# EAGLE design HandschuhProfessionell (EAGLE 6.5.0)
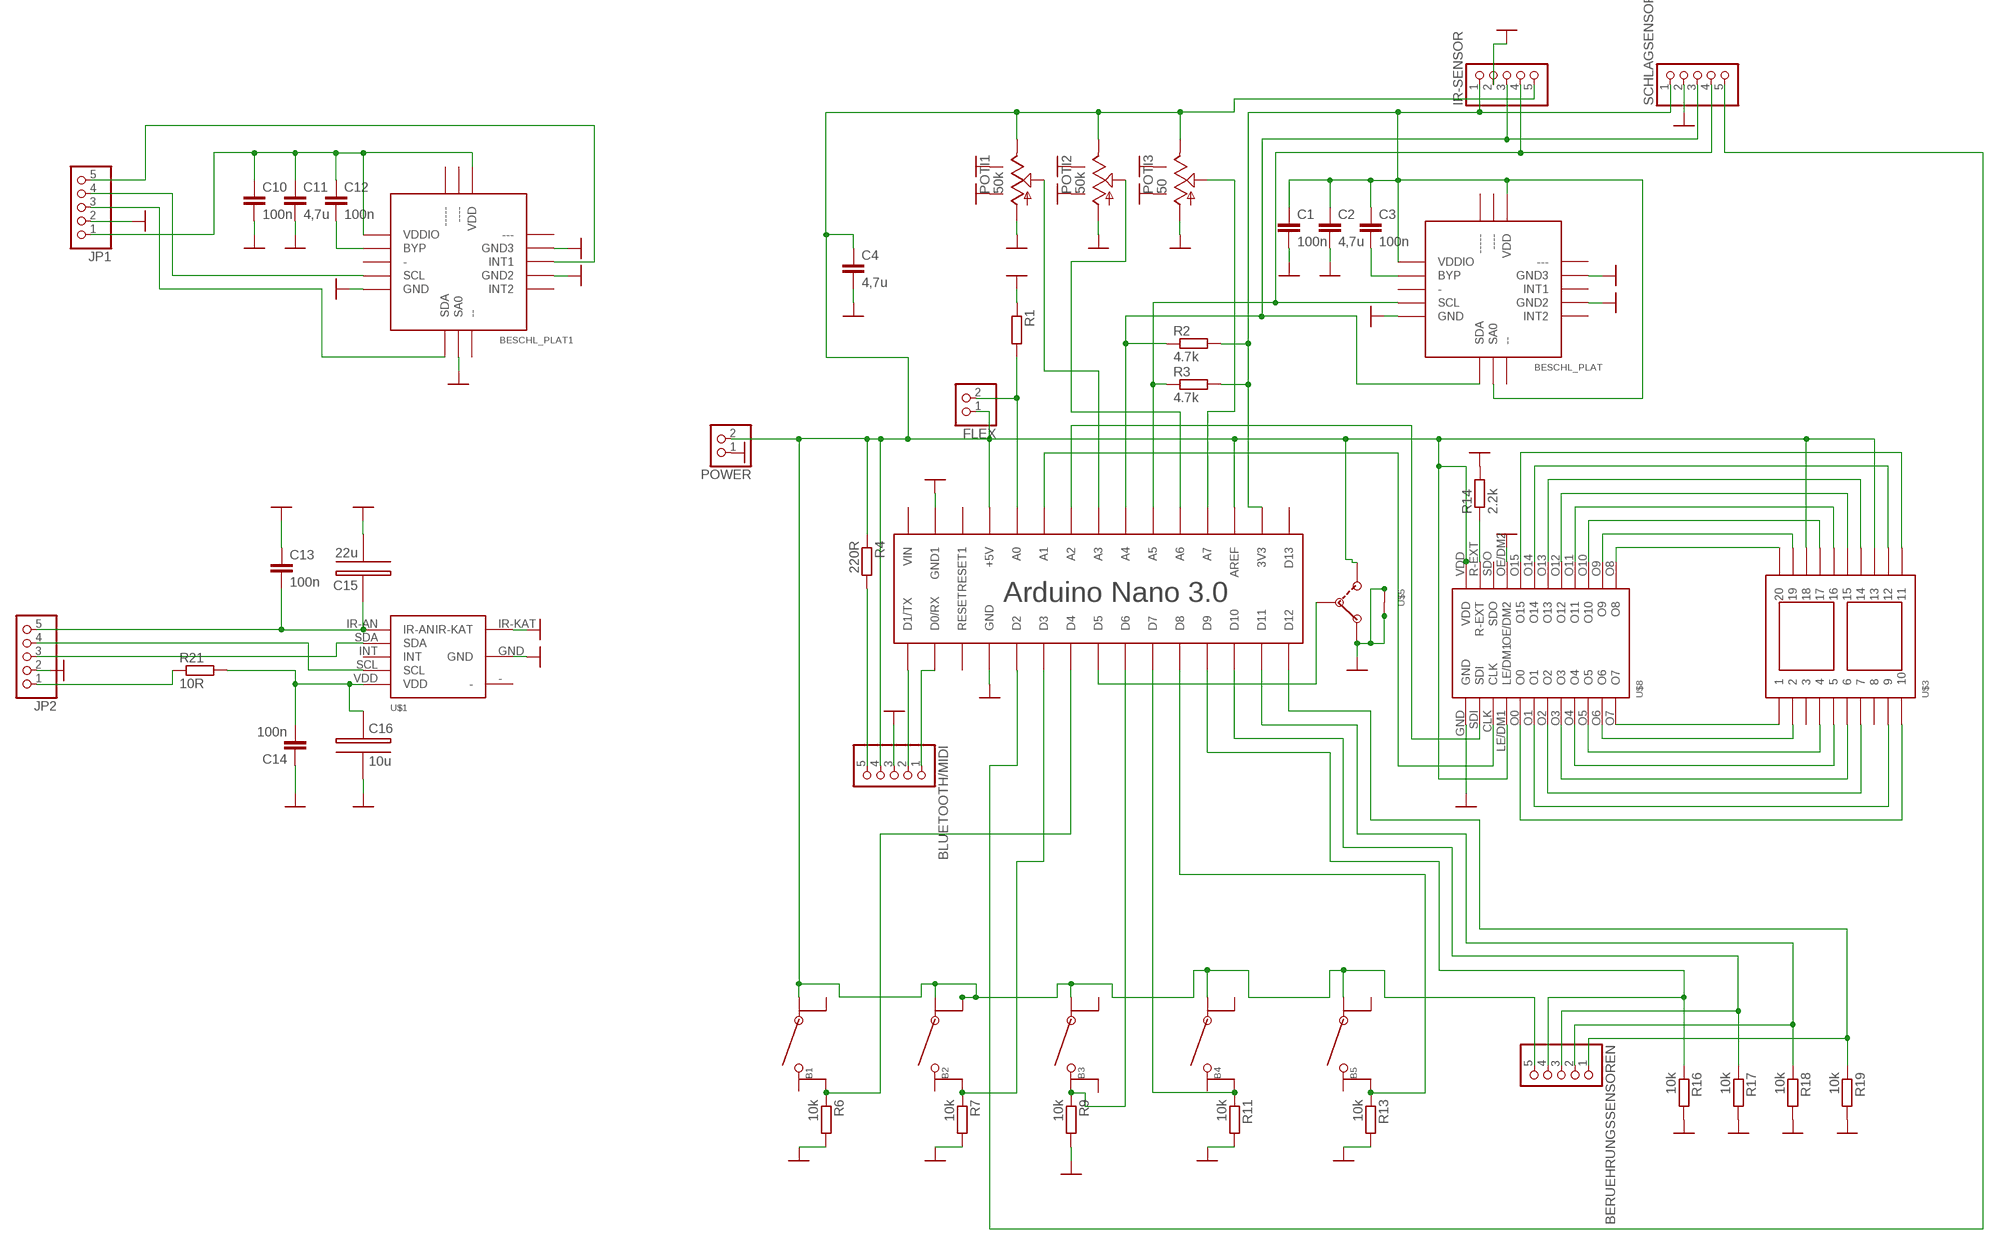
[diagram p0: schematic, sheet 1]

## Parts
B1  BUTTON  [BUTTON]
B2  BUTTON  [BUTTON]
B3  BUTTON  [BUTTON]
B4  BUTTON  [BUTTON]
B5  BUTTON  [BUTTON]
BERUEHRUNGSSENSOREN  PINHD-1X5  [1X05]
BESCHL_PLAT  BESCHLEUNIGSUNGSSENSOR  [BESCHLEUNIGUNGSSENSOR]
BESCHL_PLAT1  BESCHLEUNIGSUNGSSENSOR  [BESCHLEUNIGUNGSSENSOR]
BLUETOOTH/MIDI  PINHD-1X5  [1X05]
C1  100n  C-EUC0805  [C0805]
C2  4,7u  C-EUC0805  [C0805]
C3  100n  C-EUC0805  [C0805]
C4  4,7u  C-EUC0805  [C0805]
C10  100n  C-EUC0805  [C0805]
C11  4,7u  C-EUC0805  [C0805]
C12  100n  C-EUC0805  [C0805]
C13  100n  C-EUC0805  [C0805]
C14  100n  C-EUC0805  [C0805]
C15  22u  22U-KONDENSATOR  [22U-KONDENSATOR]
C16  10u  22U-KONDENSATOR  [22U-KONDENSATOR]
FLEX  PINHD-1X2  [1X02]
IR-SENSOR  PINHD-1X5  [1X05]
JP1  PINHD-1X5  [1X05]
JP2  PINHD-1X5/90  [1X05/90]
POTI1  50k  POTI  [POTI]
POTI2  50k  POTI  [POTI]
POTI3  50  POTI  [POTI]
POWER  PINHD-1X2  [1X02]
R1  R-EU_M0805  [M0805]
R2  4.7k  R-EU_M0805  [M0805]
R3  4.7k  R-EU_M0805  [M0805]
R4  220R  R-EU_M0805  [M0805]
R6  10k  R-EU_M0805  [M0805]
R7  10k  R-EU_M0805  [M0805]
R9  10k  R-EU_M0805  [M0805]
R11  10k  R-EU_M0805  [M0805]
R13  10k  R-EU_M0805  [M0805]
R14  2.2k  R-EU_M0805  [M0805]
R16  10k  R-EU_M0805  [M0805]
R17  10k  R-EU_M0805  [M0805]
R18  10k  R-EU_M0805  [M0805]
R19  10k  R-EU_M0805  [M0805]
R21  10R  R-EU_M0805  [M0805]
SCHLAGSENSOR  PINHD-1X5  [1X05]
U$1  IR-SENSOR  [IR-SENSOR]
U$2  ARDUINONANO  [PDIP-32]
U$3  7-SEGMENT  [7-SEGMENT]
U$5  SCHALTER  [SCHALTER]
U$8  7-SEGMENT-TREIBER  [7-SEGMENT-TREIBER]

## Nets
3,3V: BESCHL_PLAT.SA0 BESCHL_PLAT.VDD BESCHL_PLAT.VDDIO C1.1 C2.1 C3.1 IR-SENSOR.1 R2.2 R3.2 SCHLAGSENSOR.1 U$2.3V3
3,3V1: BESCHL_PLAT1.VDD BESCHL_PLAT1.VDDIO C10.1 C11.1 C12.1 JP1.1
5V: B1.3 B2.3 B2.4 B3.3 B4.3 B5.3 BERUEHRUNGSSENSOREN.5 BLUETOOTH/MIDI.4 C4.1 FLEX.1 IR-SENSOR.5 POTI1.VCC POTI2.VCC POTI3.VCC POWER.2 R4.1 U$2.+5V U$2.AREF U$3.13 U$3.18 U$5.3 U$8.LE/DM1 U$8.VDD
GND: BESCHL_PLAT1.GND BESCHL_PLAT1.GND2 BESCHL_PLAT1.GND3 BESCHL_PLAT1.SA0 BESCHL_PLAT.GND BESCHL_PLAT.GND2 BESCHL_PLAT.GND3 BLUETOOTH/MIDI.3 C1.2 C2.2 C4.2 C10.2 C11.2 C13.1 C14.1 C15.- C16.- IR-SENSOR.2 JP1.2 JP2.2 POTI1.FIX1(FUSS1) POTI1.FIX2(FUSS2) POTI1.GND POTI2.FIX1(FUSS1) POTI2.FIX2(FUSS2) POTI2.GND POTI3.FIX1(FUSS1) POTI3.FIX2(FUSS2) POTI3.GND POWER.1 R1.1 R6.2 R7.2 R9.2 R11.2 R13.2 R14.2 R16.2 R17.2 R18.2 R19.2 SCHLAGSENSOR.2 U$1.GND U$1.IR-KAT U$2.GND U$2.GND1 U$5.1 U$5.4 U$5.5 U$8.GND U$8.OE/DM2
N$2: BESCHL_PLAT1.BYP C12.2
N$4: FLEX.2 R1.2 U$2.A0
N$5: BESCHL_PLAT.BYP C3.2
N$6: SCHLAGSENSOR.5 U$2.D2
N$7: POTI1.VALUE U$2.A3
N$8: POTI2.VALUE U$2.A6
N$9: JP2.1 R21.1
N$10: BESCHL_PLAT1.SCL JP1.4
N$11: BLUETOOTH/MIDI.2 U$2.D1/TX
N$12: BLUETOOTH/MIDI.1 U$2.D0/RX
N$13: BLUETOOTH/MIDI.5 R4.2
N$14: BESCHL_PLAT1.SDA JP1.3
N$15: B1.2 R6.1 U$2.D4
N$17: B2.2 R7.1 U$2.D3
N$20: B4.2 R11.1 U$2.D7
N$21: B5.2 R13.1 U$2.D8
N$28: U$2.A2 U$8.SDI
N$30: U$2.A1 U$8.CLK
N$31: U$3.9 U$8.O1
N$32: U$3.1 U$8.O7
N$33: U$3.2 U$8.O6
N$34: U$3.4 U$8.O5
N$35: U$3.5 U$8.O4
N$36: U$3.6 U$8.O3
N$37: U$3.7 U$8.O2
N$38: U$3.10 U$8.O0
N$39: U$3.20 U$8.O8
N$40: U$3.19 U$8.O9
N$41: U$3.17 U$8.O10
N$42: U$3.16 U$8.O11
N$43: U$3.15 U$8.O12
N$44: U$3.14 U$8.O13
N$45: U$3.12 U$8.O14
N$46: U$3.11 U$8.O15
N$47: BERUEHRUNGSSENSOREN.4 R16.1 U$2.D9
N$48: R14.1 U$8.R-EXT
N$50: BESCHL_PLAT1.INT1 JP1.5
N$51: BERUEHRUNGSSENSOREN.3 R17.1 U$2.D10
N$52: BERUEHRUNGSSENSOREN.2 R18.1 U$2.D11
N$53: BERUEHRUNGSSENSOREN.1 R19.1 U$2.D12
N$54: U$2.D5 U$5.2
N$55: BESCHL_PLAT.SCL IR-SENSOR.4 R3.1 SCHLAGSENSOR.4 U$2.A5
N$56: C13.2 C15.+ JP2.5 U$1.IR-AN
N$57: C14.2 C16.+ R21.2 U$1.VDD
N$58: BESCHL_PLAT.SDA IR-SENSOR.3 R2.1 SCHLAGSENSOR.3 U$2.A4
N$59: JP2.3 U$1.SDA
N$61: JP2.4 U$1.SCL
N$67: POTI3.VALUE U$2.A7
N$69: B3.1 R9.1 U$2.D6
Unconnected: B1.1 B1.4 B2.1 B3.2 B3.4 B4.1 B4.4 B5.1 B5.4 BESCHL_PLAT1.- BESCHL_PLAT1.-- BESCHL_PLAT1.--- BESCHL_PLAT1.---- BESCHL_PLAT1.----- BESCHL_PLAT1.INT2 BESCHL_PLAT.- BESCHL_PLAT.-- BESCHL_PLAT.--- BESCHL_PLAT.---- BESCHL_PLAT.----- BESCHL_PLAT.INT1 BESCHL_PLAT.INT2 U$1.- U$1.INT U$2.D13 U$2.RESET U$2.RESET1 U$2.VIN U$3.3 U$3.8 U$8.SDO

## Notes on the sheet
- Arduino Nano 3.0

## Library data of the parts
B1-B5 = Handschuh:BUTTON
BERUEHRUNGSSENSOREN BLUETOOTH/MIDI IR-SENSOR JP1 SCHLAGSENSOR = pinhead:PINHD-1X5: PIN HEADER
BESCHL_PLAT BESCHL_PLAT1 = beschleunigungssensor:BESCHLEUNIGSUNGSSENSOR
C1-C4 C10-C14 = rcl:C-EU: CAPACITOR, European symbol
C15 C16 = Handschuh:22U-KONDENSATOR
FLEX POWER = pinhead:PINHD-1X2: PIN HEADER
JP2 = pinhead_wurz-kompatibel:PINHD-1X5: PIN HEADER
POTI1-POTI3 = Poti:POTI
R1-R4 R6 R7 R9 R11 R13 R14 R16-R19 R21 = rcl:R-EU_: RESISTOR, European symbol
U$1 = Handschuh:IR-SENSOR
U$2 = jet-lib:ARDUINONANO
U$3 = Handschuh:7-SEGMENT
U$5 = Handschuh:SCHALTER
U$8 = Handschuh:7-SEGMENT-TREIBER

## Board
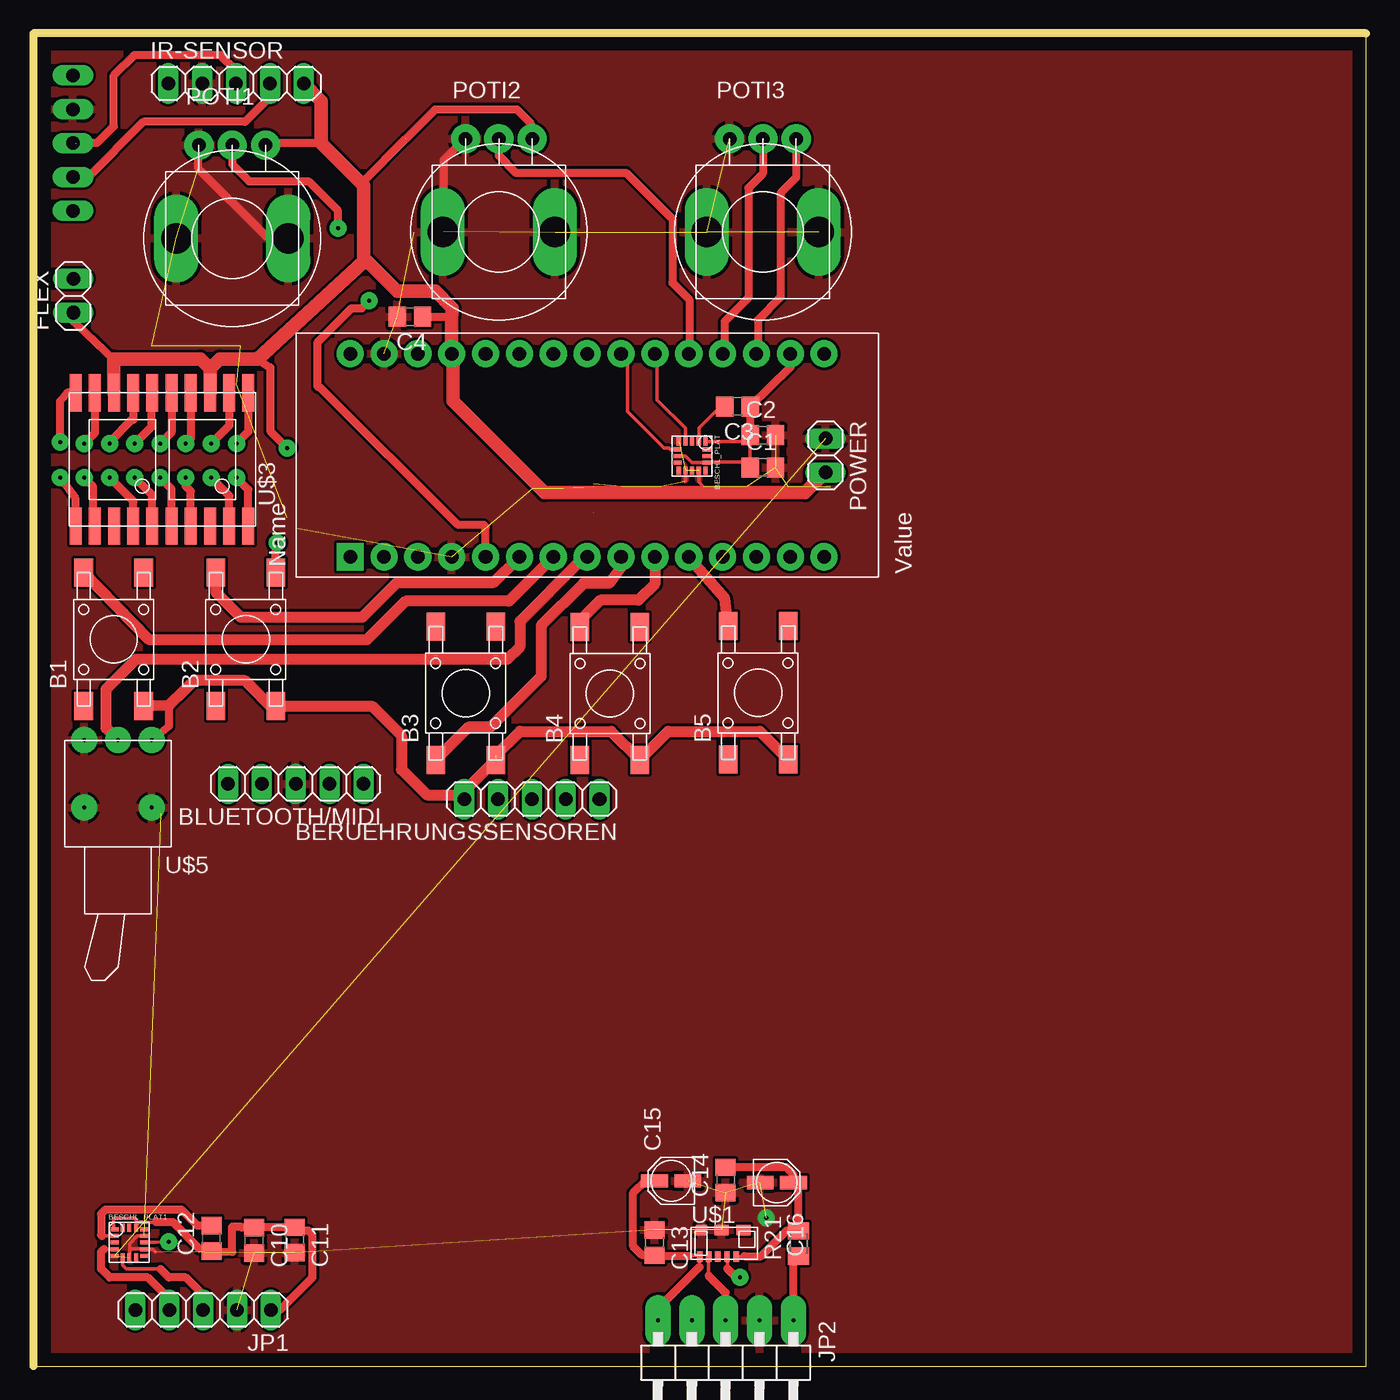
[diagram p1: board, top side]
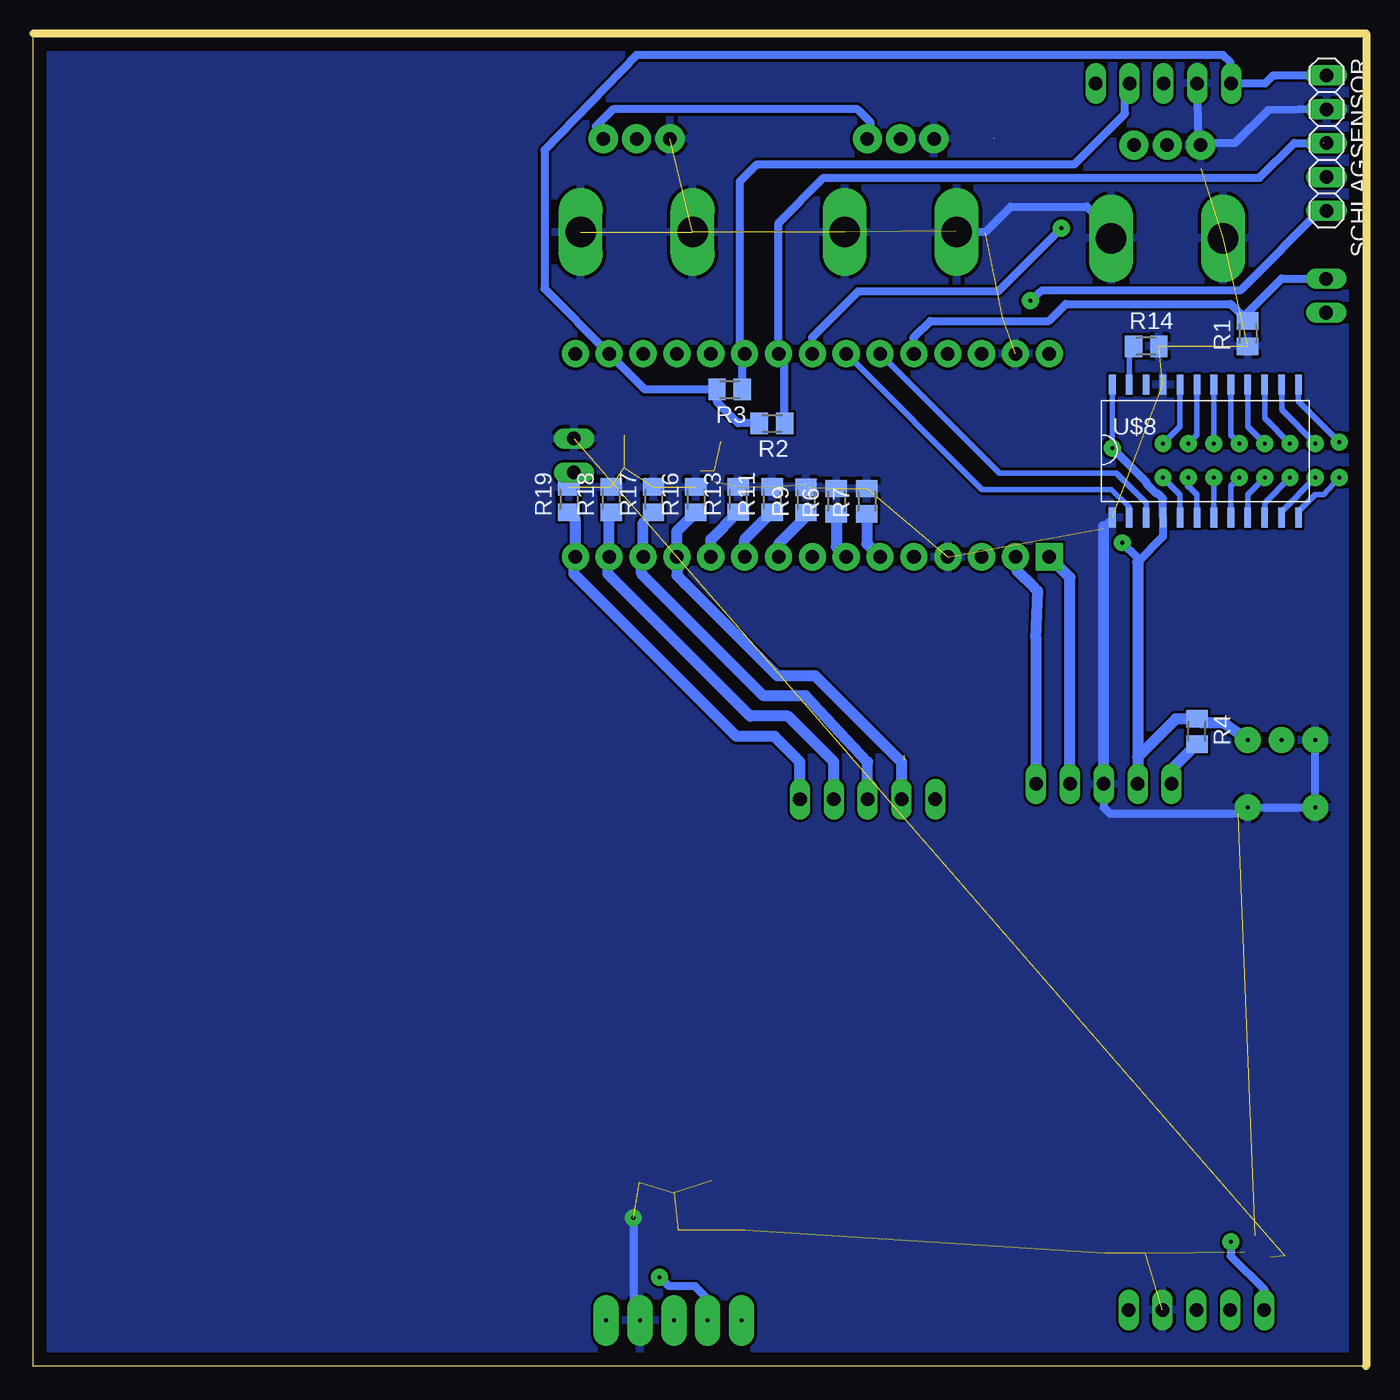
[diagram p2: board, bottom side, seen from below]

Size 100 x 100 mm. Coordinates in mm from the lower left corner, seen from the top.
Outline: 0,0 100,0 100,100 0,100 0,0
Copper layers (1*16): Top 0.035mm / dielectric 1.5mm / Bottom 0.035mm
Design rules "default *": minimum track width 10mil, minimum drill 24mil, track to track 8mil, track to pad 8mil, pad to pad 5mil, via to via 8mil, smd to smd 8mil, copper to edge 40mil, drill to drill 8mil, minimum pad ring 10mil, minimum via ring 8mil, stop-mask expansion 4mil, vias tented up to drill 0mil, thermal gap 10mil

### Footprints (pad centres in the part's own frame; a part is rotated, then mirrored left to right if it is on the bottom)
BUTTON = smd 2.1 x 1.4: 1 0,0; 2 10,0; 3 0,-4.5; 4 10,-4.5
1X05 = drill 1.016 long: 1 -5.08,0; 2 -2.54,0; 3 0,0; 4 2.54,0; 5 5.08,0
BESCHLEUNIGUNGSSENSOR = smd 0.61 x 0.305: - 0.4,-1.5; --- 2.6,-0.5; BYP 0.4,-1; GND 0.4,-2.5; GND2 2.6,-2; GND3 2.6,-1; INT1 2.6,-1.5; INT2 2.6,-2.5; SCL 0.4,-2; VDDIO 0.4,-0.5 | smd 0.305 x 0.61: -- 2,-2.6; ---- 1.5,-0.4; ----- 1,-0.4; SA0 1.5,-2.6; SDA 1,-2.6; VDD 2,-0.4
C0805 = smd 1.3 x 1.5: 1 -0.95,0; 2 0.95,0
22U-KONDENSATOR = smd 1 x 2: + 0,-0.5; - 0,-3
1X02 = drill 1.016 long: 1 -1.27,0; 2 1.27,0
1X05/90 = drill 0.305 pad 1.93 long: 1 -5.08,-3.81; 2 -2.54,-3.81; 3 0,-3.81; 4 2.54,-3.81; 5 5.08,-3.81
POTI = drill 2.286 pad 2.54 long: FIX1 -4.2,0; FIX2 4.2,0 | drill 1.016 pad 2.184: GND -2.5,7; VALUE 0,7; VCC 2.5,7
M0805 = smd 1.3 x 1.6: 1 -0.95,0; 2 0.95,0
IR-SENSOR = smd 1.05 x 0.8: - 3.925,-0.2; GND 2.275,-0.2 | smd 0.4 x 0.8: INT 2.02,-2.2; IR-AN 0.65,-2.2; SCL 2.705,-2.2; SDA 1.335,-2.2; VDD 3.39,-2.2 | smd 0.83 x 0.8: IR-KAT 0.785,-0.2
PDIP-32 = drill 1.016 pad 2.032: 3V3 15.24,-35.56; +5V 15.24,-10.16; A0 15.24,-12.7; A1 15.24,-15.24; A2 15.24,-17.78; A3 15.24,-20.32; A4 15.24,-22.86; A5 15.24,-25.4; A6 15.24,-27.94; A7 15.24,-30.48; AREF 15.24,-33.02; D0/RX 0,-5.08; D2 0,-12.7; D3 0,-15.24; D4 0,-17.78; D5 0,-20.32; D6 0,-22.86; D7 0,-25.4; D8 0,-27.94; D9 0,-30.48; D10 0,-33.02; D11 0,-35.56; D12 0,-38.1; D13 15.24,-38.1; GND 0,-10.16; GND1 15.24,-5.08; RESET 0,-7.62; RESET1 15.24,-7.62; VIN 15.24,-2.54 | drill 1.016 pad 2.032 square: D1/TX 0,-2.54
7-SEGMENT = smd 0.9 x 2.8: 1 0,-10; 2 1.44,-10; 3 2.88,-10; 4 4.32,-10; 5 5.76,-10; 6 7.2,-10; 7 8.64,-10; 8 10.08,-10; 9 11.52,-10; 10 12.96,-10; 11 12.96,0; 12 11.52,0; 13 10.08,0; 14 8.64,0; 15 7.2,0; 16 5.76,0; 17 4.32,0; 18 2.88,0; 19 1.44,0; 20 0,0
SCHALTER = drill 0.305 pad 1.93: 1 -2.54,2.54; 2 0,2.54; 3 2.54,2.54; 4 -2.54,-2.54; 5 2.54,-2.54
7-SEGMENT-TREIBER = smd 0.5 x 1.5: CLK -11.43,-10; GND -13.97,-10; LE/DM1 -10.16,-10; O0 -8.89,-10; O1 -7.62,-10; O2 -6.35,-10; O3 -5.08,-10; O4 -3.81,-10; O5 -2.54,-10; O6 -1.27,-10; O7 0,-10; O8 0,0; O9 -1.27,0; O10 -2.54,0; O11 -3.81,0; O12 -5.08,0; O13 -6.35,0; O14 -7.62,0; O15 -8.89,0; OE/DM2 -10.16,0; R-EXT -12.7,0; SDI -12.7,-10; SDO -11.43,0; VDD -13.97,0

### Placement (x,y rotation side)
B1  3.78,49.53 90 top
B2  13.69,49.53 90 top
B3  30.2,45.49 90 top
B4  41.01,45.47 90 top
B5  52.13,45.51 90 top
BERUEHRUNGSSENSOREN  37.4,42.55 180 top
BESCHL_PLAT  50.93,69.79 270 top
BESCHL_PLAT1  5.71,10.78 0 top
BLUETOOTH/MIDI  19.68,43.69 180 top
C1  54.74,67.44 0 top
C2  54.74,69.85 0 top
C3  52.83,72.01 180 top
C4  28.26,78.74 180 top
C10  16.57,9.45 270 top
C11  19.61,9.47 270 top
C12  13.37,9.59 90 top
C13  46.61,9.27 270 top
C14  51.94,13.97 90 top
C15  46.1,13.91 90 top
C16  57.53,13.78 270 top
FLEX  3,80.31 90 top
IR-SENSOR  15.21,96.24 0 top
JP1  12.74,4.22 180 top
JP2  51.94,-0.38 180 top
POTI1  14.92,84.62 0 top
POTI2  34.92,85.09 0 top
POTI3  54.74,85.09 0 top
POWER  59.44,68.33 270 top
R1  8.89,77.47 90 bottom
R2  44.58,70.74 180 bottom
R3  47.75,73.28 180 bottom
R4  12.7,47.62 270 bottom
R6  39.75,64.9 90 bottom
R7  37.47,64.9 90 bottom
R9  42.03,64.99 90 bottom
R11  44.57,65.02 90 bottom
R13  47.12,65.03 90 bottom
R14  16.51,76.52 0 bottom
R16  50.29,65.02 90 bottom
R17  53.47,65.02 90 bottom
R18  56.64,65.02 90 bottom
R19  59.82,65.02 90 bottom
R21  57.4,9.21 90 top
SCHLAGSENSOR  2.97,91.76 270 bottom
U$1  49.34,10.41 0 top
U$2  21.23,60.72 90 top
U$3  3.17,73.03 0 top
U$5  6.35,44.45 0 top
U$8  5.08,73.66 0 bottom

### Tracks (layer width: path | path; a pad name or v marks a point on that pad's centre or on a via)
3,3V
  Top 0.254: 51.19,69.39 BESCHL_PLAT.VDDIO 53.32,69.39 C2.1 C1.1 53.41,67.82 50.56,67.82 BESCHL_PLAT.VDD 49.43,67.79 48.93,68.29 BESCHL_PLAT.SA0
  Top 0.61: U$2.3V3 56.84,74.99 C3.1 C2.1
  Bottom 0.406: 48.7,72.64 R3.2
  Bottom 0.61: R2.2 47.12,70.74 48.7,72.33 48.7,72.64 | R3.2 54.11,73.28 U$2.3V3 61.66,80.83 61.66,91.25 54.76,98.37 10.74,98.37 10.16,97.79 IR-SENSOR.1 7.58,96.24 6.99,96.84 3.22,96.84 SCHLAGSENSOR.1
3,3V1
  Top 0.254: BESCHL_PLAT1.VDD 7.71,10.57 | 7.71,10.57 7.71,11.02 7.62,11.11 6.03,11.11 6.03,10.36 BESCHL_PLAT1.VDDIO | C12.1 13.09,8.64 | 15.53,10.48 C10.1 15.63,10.42 | 19.55,10.16 C11.1 | 7.71,10.57 7.94,10.79 9.21,10.79
  Top 0.61: C12.1 12.45,8.82 10.48,10.79 9.21,10.79 | 13.09,8.64 14.92,8.57 14.92,10.48 15.53,10.48 | JP1.1 18.51,4.22 20.95,6.67 20.95,9.84 20.64,10.16 19.55,10.16 | C11.1 15.63,10.42
5V  (via drill 0.3 pad 1.27)  (2 unrouted)
  Top 0.406: B2.3 18.19,49.12 | 31.39,78.74 31.39,78.91 31.43,78.95 | B4.3 45.51,45.51 | 32.13,42.86 BERUEHRUNGSSENSOREN.5
  Top 0.61: B2.4 18.19,61.18 18.29,61.28 v18.29,61.77 | 16.83,75.56 17.78,74.93 17.78,70.17 v19.05,68.9 | POTI3.VCC 57.24,89.18 56.07,88.01 56.07,80.2 54.36,78.49 54.36,76.07 U$2.AREF | 20,96.2 IR-SENSOR.5 | C4.1 31.39,78.74 | 24.77,83.19 24.77,82.87 | 6.03,75.56 3.33,78.11 2.9,78.54 FLEX.1 | 6.03,73.05 U$3.18 | 21.59,91.76 17.44,91.76 POTI1.VCC | 24.77,88.58 24.77,88.9 27.94,92.08 | 27.95,92.09 30.16,94.3 36.26,94.3 37.34,93.22 37.34,92.18 POTI2.VCC | 10.16,49.56 10.16,48.01 U$5.3
  Top 0.813: 18.19,49.12 15.88,51.44 12.06,51.44 11.43,50.8 10.16,49.56 B1.3 | B2.3 25.4,49.53 27.62,47.31 27.62,44.77 29.53,42.86 32.13,42.86 | 34.7,45.81 36.51,47.62 43.36,47.62 B4.3 | 45.51,45.51 47.62,47.62 54.52,47.62 B5.3 | BERUEHRUNGSSENSOREN.5 32.32,43.12 B3.3
  Top 1.016: U$3.13 13.26,74.85 | 13.26,74.85 13.97,75.56 16.83,75.56 24.77,82.87 | 31.39,78.74 U$2.+5V 31.5,75.86 31.5,72.39 38.35,65.53 57.91,65.53 POWER.2 | 13.26,74.85 12.54,75.56 6.03,75.56 6.03,73.05 | IR-SENSOR.5 21.59,94.89 21.59,91.76 24.77,88.58 24.77,83.19 27.3,80.64 30.16,80.64 31.43,79.38 31.43,78.95
  Bottom 0.406: 12.38,48.26 R4.1 | v19.05,68.9 U$8.VDD
  Bottom 0.61: POTI3.VCC 57.78,92.13 57.78,93.03 56.52,94.3 38.16,94.3 37.21,93.34 37.21,92.3 POTI2.VCC | v19.05,68.9 16.46,66.31 16.46,66.19 15.75,65.48 15.65,65.48 15.25,65.09 15.24,65.09 U$8.LE/DM1 15.24,62.23 17.14,60.33 17.14,60.63 v18.29,61.77
  Bottom 0.813: U$5.3 10.72,48.26 12.38,48.26 | R4.1 14.29,48.58 17.14,45.72 | 17.14,45.72 BLUETOOTH/MIDI.4 | 17.14,60.33 17.14,45.72
GND  (via drill 0.3 pad 1.27)  (39 unrouted)
  Top 0.254: 49.96,67.16 BESCHL_PLAT.GND3 49.93,66.34 R16.2 | BESCHL_PLAT.GND2 48.93,66.39 48.9,66.36 | BESCHL_PLAT1.GND3 7.8,9.78 7.21,9.2 7.21,8.79 | BESCHL_PLAT1.SA0 7.21,8.79 | 7.21,8.79 BESCHL_PLAT1.GND2 8.95,8.78 9.14,8.59
  Top 0.406: 17.46,84.77 17.4,84.77 17.4,84.8
  Top 0.61: POTI2.GND 32.4,92.09 30.8,90.49 30.8,85.16 POTI2.FIX1 | 17.46,84.77 12.38,89.85 12.38,91.73 POTI1.GND | 17.4,84.8 19.12,84.8 POTI1.FIX2 19.05,84.62 19.05,84.58
  Bottom 0.406: 19.68,63.02 U$8.GND 19.05,63.55 19.76,62.84 | R9.2 42.03,66.19 42.05,66.21
  Bottom 0.61: U$5.1 U$5.4 U$5.5 9.59,41.47 19.24,41.47 19.68,41.91 BLUETOOTH/MIDI.3 | IR-SENSOR.2 12.62,91.97 POTI1.GND 12.41,91.76 9.84,91.76 7.35,94.25 SCHLAGSENSOR.2 | v54.99,11.13 54.99,3.93 JP2.2 | POTI1.FIX2 19.05,84.69 19.05,85.09 20.95,87 26.67,87 28.57,85.09 POTI2.FIX1
  Bottom 0.813: BLUETOOTH/MIDI.3 19.68,63.02
  pour Top: 0,100 100,100 100,0 0,0
  pour Bottom: 0,100 100,100 100,0 0,0
N$2
  Top 0.254: BESCHL_PLAT1.BYP 5.14,9.78
  Top 0.61: C12.2 12.32,10.54 11.11,11.75 5.4,11.75 5.08,11.43 5.08,9.84 5.14,9.78
N$4
  Bottom 0.406: R1.2 8.89,79.06 | 33.97,76.66 33.93,76.62
  Bottom 0.61: U$2.A0 33.93,76.62 | 8.89,79.06 6.35,81.6 3.3,81.6 | 3.3,81.6 3.2,81.6 | 33.97,76.66 33.97,77.15 32.7,78.42 23.81,78.42 22.54,79.69 10.16,79.69 R1.2 | FLEX.2 3.29,81.58 3.3,81.6
N$5
  Top 0.254: BESCHL_PLAT.BYP 49.93,70.37 51.56,72.01
  Top 0.61: 51.56,72.01 C3.2
N$6  (via drill 0.3 pad 1.27)
  Top 0.406: 33.93,62.97 33.78,63.12 | 21.48,73.46 21.34,73.46
  Top 0.61: U$2.D2 33.93,62.97 | 33.78,63.12 31.88,63.12 21.48,73.46 | 21.34,73.46 21.34,76.83 23.88,79.38 24.65,79.38 v25.21,79.93
  Bottom 0.61: SCHLAGSENSOR.5 3.17,87 9.46,80.71 24.32,80.71 v25.21,79.93
N$7  (via drill 0.3 pad 1.27)
  Top 0.61: POTI1.VALUE 14.92,90.17 16.19,88.9 20.64,88.9 22.86,86.68 v22.86,85.39
  Bottom 0.61: U$2.A3 41.55,77.19 38.1,80.64 27.61,80.64 v22.86,85.39
N$8
  Top 0.406: 49.02,76.11 U$2.A6
  Top 0.61: POTI2.VALUE 34.92,90.81 36.2,89.53 44.45,89.53 47.94,86.04 47.94,81.28 49.21,80.01 49.21,76 U$2.A6
N$9
  Top 0.254: 57.02,7.88 R21.1
  Top 0.61: JP2.1 57.02,7.88
N$10
  Top 0.254: BESCHL_PLAT1.SCL 5.29,8.78
  Top 0.61: JP1.4 10.2,5.04 8.57,6.67 5.71,6.67 5.08,7.3 5.08,8.57 5.29,8.78
N$11
  Bottom 0.813: BLUETOOTH/MIDI.2 22.23,59.18 U$2.D1/TX
N$12
  Bottom 0.406: U$2.D0/RX 26.24,60.65 | 24.64,58.17 24.84,58.37 24.87,58.37
  Bottom 0.813: BLUETOOTH/MIDI.1 24.77,54.61 24.64,58.17 | 24.87,58.37 26.24,59.74 26.24,60.65
N$13
  Bottom 0.813: BLUETOOTH/MIDI.5 14.61,44.77 R4.2
N$14
  Top 0.254: 9.53,7.3 6.99,7.3 6.71,7.58 BESCHL_PLAT1.SDA
  Top 0.61: JP1.3 12.74,5.36 11.43,6.67 10.16,6.67 9.53,7.3
N$15
  Top 0.406: U$2.D4
  Top 0.813: U$2.D4 35.69,57.4 27.94,57.4 25.02,54.48 8.71,54.48 B1.2
  Bottom 0.813: R6.1 39.75,61.46 U$2.D4
N$17
  Top 0.813: B2.2 13.69,58.06 15.56,56.2 24.7,56.2 27.3,58.8 34.55,58.8 U$2.D3
  Bottom 0.813: R7.1 37.47,61.72 U$2.D3
N$20
  Top 0.406: 41.15,56.26 41.01,56 B4.2 40.96,55.52 40.96,55.88
  Top 0.813: U$2.D7 46.63,58.7 45.4,57.47 42.55,57.47 40.96,55.88
  Bottom 0.813: U$2.D7 46.63,62.01 R11.1
N$21
  Top 0.813: B5.2 51.88,57.59 U$2.D8
  Bottom 0.813: U$2.D8 49.17,62.03 R13.1
N$28
  Bottom 0.406: U$8.SDI 17.78,64.45 19.11,65.79 28.83,65.79 U$2.A2
N$30
  Bottom 0.406: U$2.A1 27.56,67.06 27.5,66.99 18.73,66.99 16.51,64.77 U$8.CLK
N$31  (via drill 0.3 pad 1.27)
  Top 0.61: U$3.9 14.7,65.31 v13.34,66.67
  Bottom 0.406: U$8.O1 12.7,65.41 13.34,66.04
  Bottom 0.61: v13.34,66.67 13.34,66.04
N$32  (via drill 0.3 pad 1.27)
  Top 0.61: U$3.1 3.17,65.09 v2.01,66.67
  Bottom 0.406: v2.01,66.67 3.17,65.41 3.81,65.41 5.08,64.14 U$8.O7
N$33  (via drill 0.3 pad 1.27)
  Top 0.406: U$3.2 4.62,63.33
  Top 0.61: 4.62,63.33 4.45,64.14 4.45,66.04 v3.81,66.67
  Bottom 0.406: U$8.O6 6.35,64.14 v3.81,66.67
N$34  (via drill 0.3 pad 1.27)
  Top 0.61: U$3.4 7.5,64.89 v5.71,66.67
  Bottom 0.406: v5.71,66.67 7.62,64.77 U$8.O5
N$35  (via drill 0.3 pad 1.27)
  Top 0.61: v7.62,66.67 8.89,65.41 8.89,63.07 U$3.5
  Bottom 0.406: U$8.O4 8.89,65.41 v7.62,66.67
N$36  (via drill 0.3 pad 1.27)
  Top 0.61: U$3.6 10.38,65.83 v9.53,66.67
  Bottom 0.406: v9.53,66.67 10.16,66.04 U$8.O3
N$37  (via drill 0.3 pad 1.27)
  Top 0.61: U$3.7 11.81,65.66 11.43,66.04 v11.43,66.67
  Bottom 0.406: U$8.O2 v11.43,66.67
N$38  (via drill 0.3 pad 1.27)
  Top 0.61: U$3.10 16.14,65.78 v15.24,66.67
  Bottom 0.406: U$8.O0 13.97,65.41 v15.24,66.67
N$39  (via drill 0.3 pad 1.27)
  Top 0.61: U$3.20 2.54,73.03 2.01,72.39 v2.01,69.32
  Bottom 0.406: U$8.O8 5.08,72.39 v2.01,69.32
N$40  (via drill 0.3 pad 1.27)
  Top 0.61: U$3.19 4.62,70.02 v3.81,69.22
  Bottom 0.406: U$8.O9 6.35,71.75 v3.81,69.22
N$41  (via drill 0.3 pad 1.27)
  Top 0.61: U$3.17 7.5,71.12 | 7.5,71.12 7.5,71 | v5.71,69.22 5.71,69.34 7.5,71.12
  Bottom 0.406: U$8.O10 7.62,71.12 v5.71,69.22
N$42  (via drill 0.3 pad 1.27)
  Top 0.61: v7.62,69.22 8.89,70.48 8.89,72.98 U$3.16
  Bottom 0.406: U$8.O11 8.89,70.48 v7.62,69.22
N$43  (via drill 0.3 pad 1.27)
  Top 0.61: U$3.15 10.38,70.06 v9.53,69.22
  Bottom 0.406: U$8.O12 10.16,69.85 v9.53,69.22
N$44  (via drill 0.3 pad 1.27)
  Top 0.61: U$3.14 11.81,69.6 v11.43,69.22
  Bottom 0.406: v11.43,69.22 U$8.O13
N$45  (via drill 0.3 pad 1.27)
  Top 0.61: U$3.12 14.7,70.58 v13.34,69.22
  Bottom 0.406: U$8.O14 12.7,69.85 v13.34,69.22
N$46  (via drill 0.3 pad 1.27)
  Top 0.61: U$3.11 16.14,70.11 v15.24,69.22
  Bottom 0.406: U$8.O15 13.97,70.48 v15.24,69.22
N$47
  Bottom 0.813: R16.1 51.71,62.65 U$2.D9 51.71,59.33 44.2,51.82 41.34,51.82 34.86,45.34 BERUEHRUNGSSENSOREN.4
N$48
  Bottom 0.406: R14.1 17.78,75.88 U$8.R-EXT
N$50  (via drill 0.3 pad 1.27)
  Top 0.254: BESCHL_PLAT1.INT1 9.13,9.28 v10.14,9.32
  Bottom 0.254: 7.62,4.26 JP1.5
  Bottom 0.61: v10.14,9.32 10.16,8.26 7.62,5.71 7.62,4.26
N$51
  Bottom 0.406: 54.25,63.29 R17.1 | 54.36,60.62 U$2.D10
  Bottom 0.813: U$2.D10 54.25,63.29 | BERUEHRUNGSSENSOREN.3 37.4,45.34 42.04,50.29 45.21,50.29 54.36,59.44 54.36,60.62
N$52
  Bottom 0.406: 56.79,63.92 R18.1 | 56.9,60.62 U$2.D11
  Bottom 0.813: U$2.D11 56.79,63.92 | BERUEHRUNGSSENSOREN.2 39.94,45.34 43.37,48.77 46.23,48.77 56.9,59.44 56.9,60.62
N$53
  Bottom 0.406: 59.33,63.59 R19.1 | 59.44,60.62 U$2.D12
  Bottom 0.813: U$2.D12 59.33,63.59 | BERUEHRUNGSSENSOREN.1 42.48,45.34 44.39,47.24 47.24,47.24 59.44,59.44 59.44,60.62
N$54
  Top 0.813: U$5.2 5.46,47.88 5.46,50.8 7.68,53.02 35.56,53.02 36.51,53.98 36.51,55.88 40.92,60.28 U$2.D5
N$55
  Top 0.254: BESCHL_PLAT.SCL 48.93,70.36 46.8,72.49 46.8,75.8 U$2.A5
  Top 0.61: SCHLAGSENSOR.4 4.07,89.17 8.26,93.36 15.89,93.36 17.78,95.25 17.78,95.57 IR-SENSOR.4
  Bottom 0.406: 46.8,75.79 U$2.A5 46.65,75.96 46.8,75.82
  Bottom 0.61: R3.1 46.8,75.79 | 46.65,75.96 46.48,76.14 46.99,76.83 46.99,88.9 45.72,90.17 21.91,90.17 18.1,93.98 18.1,95.89 IR-SENSOR.4
N$56
  Top 0.254: 49.99,7.44 U$1.IR-AN 49.88,8.32 49.28,8.32 49.21,8.26 | 46,14 46.51,14 C15.+
  Top 0.406: 46.99,3.56 JP2.5
  Top 0.61: 49.99,7.44 46.99,4.45 46.99,3.56 | 46,14 45,13 45,9 45.68,8.32 C13.2 46.67,8.26 49.21,8.26
N$57
  Top 0.254: 57.4,13.41 C16.+ | C14.2 | 52.77,8.26 U$1.VDD 53.3,8.21 53.34,8.26
  Top 0.61: 57.4,13.41 R21.2 56.51,10.16 54.61,8.26 53.34,8.26 | C16.+ 57.03,14.41 56.52,14.92 C14.2
N$58  (1 unrouted)
  Top 0.254: BESCHL_PLAT.SDA 47.8,68.79 47.69,68.9 47.31,68.9 44.58,71.63 44.58,75.48 U$2.A4
  Top 0.61: SCHLAGSENSOR.3 3.22,91.76 4.76,91.76 6.03,93.03 6.03,96.84 7.57,98.37 14.02,98.37 15.16,97.23 IR-SENSOR.3
  Bottom 0.61: 3.17,91.76 5.4,91.76 8,89.15 40.7,89.15 44.09,85.77 U$2.A4 43.63,75.5 R2.1
N$59
  Top 0.254: U$1.SDA 50.67,6.79
  Top 0.61: JP2.3 51.94,5.52 50.67,6.79
N$61  (via drill 0.3 pad 1.27)
  Top 0.254: 52.07,7.32 52.07,8.19 U$1.SCL
  Top 0.61: v53.01,6.68 52.7,6.68 52.07,7.32
  Bottom 0.61: JP2.4 49.4,5.05 50.34,5.99 52.32,5.99 v53.01,6.68
N$67
  Top 0.61: POTI3.VALUE 54.74,89.48 53.65,88.39 53.65,80.16 51.87,78.38 51.87,76.12 U$2.A7
N$69  (1 unrouted)
  Top 0.813: U$2.D6 44.09,59.97 43.18,58.74 41.27,58.74 38.1,55.56 38.1,51.75 34.29,47.94 32.65,47.94 B3.1
  Bottom 0.406: 42.04,63.75 R9.1
  Bottom 0.813: U$2.D6 44.09,61.7 42.04,63.75
(copper drawn outside any net)
  shapes: Top area x2